# Altium schematic sheet 06_i2cDisplay.SchDoc
size A
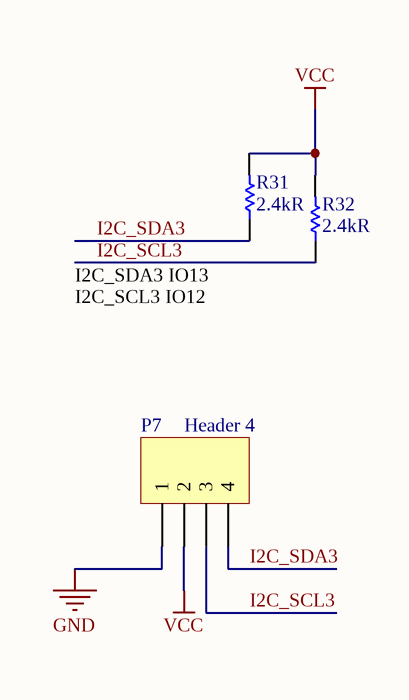
[diagram p0: 06_i2cDisplay.SchDoc]

## Parts
P7  Header 4  [HDR1X4]
R31  value 2.4kR  [RESC1608X50X30ML20T20]  (hidden comment: RR0816P-242-D)
R32  value 2.4kR  [RESC1608X50X30ML20T20]  (hidden comment: RR0816P-242-D)

## Nets
GND: P7.1
VCC: P7.2 R31.2 R32.2
I2C_SCL3: P7.3 R32.1
I2C_SDA3: P7.4 R31.1

## Notes on the sheet
- I2C_SDA3 IO13
  I2C_SCL3 IO12
  For LCD

## Library data of the parts
P7 = Header 4: Header, 4-Pin; LatestRevisionDate: 17-Jul-2002; LatestRevisionNote: Re-released for DXP Platform.; Publisher: Altium Limited
R31 R32 = CMP-2000-02561-1: Manufacturer: Susumu; Part Number: RR0816P-242-D